# EAGLE design charger (EAGLE 9.6.2)
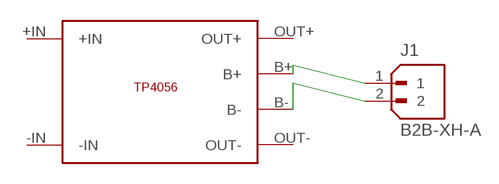
[diagram p0: schematic, sheet 1]

## Parts
J1  B2B-XH-A  [JST_B2B-XH-A]
U$1  TP4056  [TP4056]

## Nets
N$1: J1.1 U$1.B+
N$2: J1.2 U$1.B-
Unconnected: U$1.+IN U$1.-IN U$1.OUT+ U$1.OUT-

## Library data of the parts
J1 = B2B-XH-A:B2B-XH-A: Check availability <https://pricing.snapeda.com/parts/B2B-XH-A/JST%20Sales/view-part?ref=eda>; AVAILABILITY: In Stock; CHECK_PRICES: https://www.snapeda.com/parts/B2B-XH-A/JST+Sales+America+Inc./view-part/?ref=eda; DESCRIPTION: Connector Header Through Hole 2 position 0.098 (2.50mm); MF: JST Sales; MP: B2B-XH-A; PACKAGE: None; PRICE: None; PURCHASE-URL: https://www.snapeda.com/api/url_track_click_mouser/?unipart_id=552747&manufacturer=JST Sales&part_name=B2B-XH-A&search_term=b2bxh-a; SNAPEDA_LINK: https://www.snapeda.com/parts/B2B-XH-A/JST+Sales+America+Inc./view-part/?ref=snap
U$1 = TP4056:TP4056

## Board
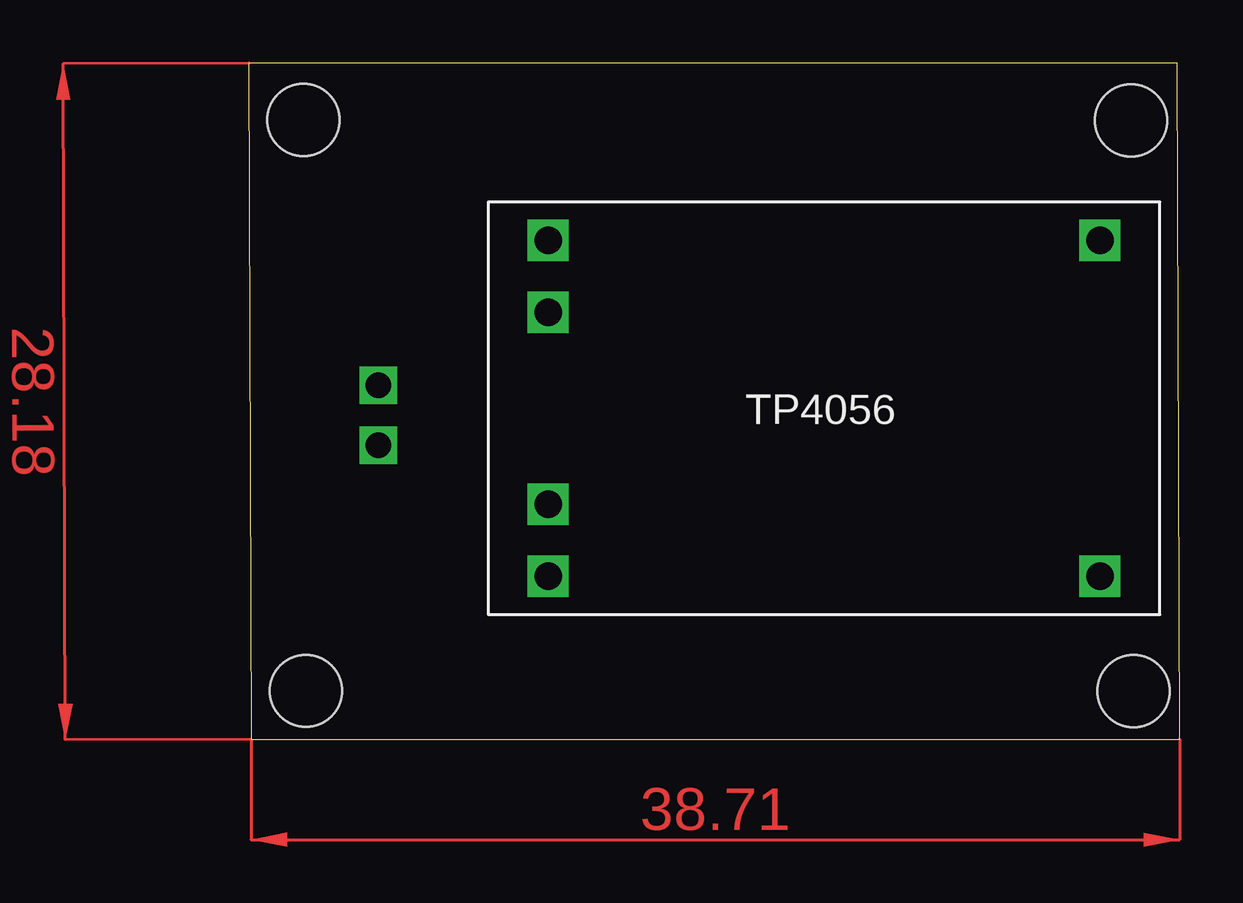
[diagram p1: board, top side]
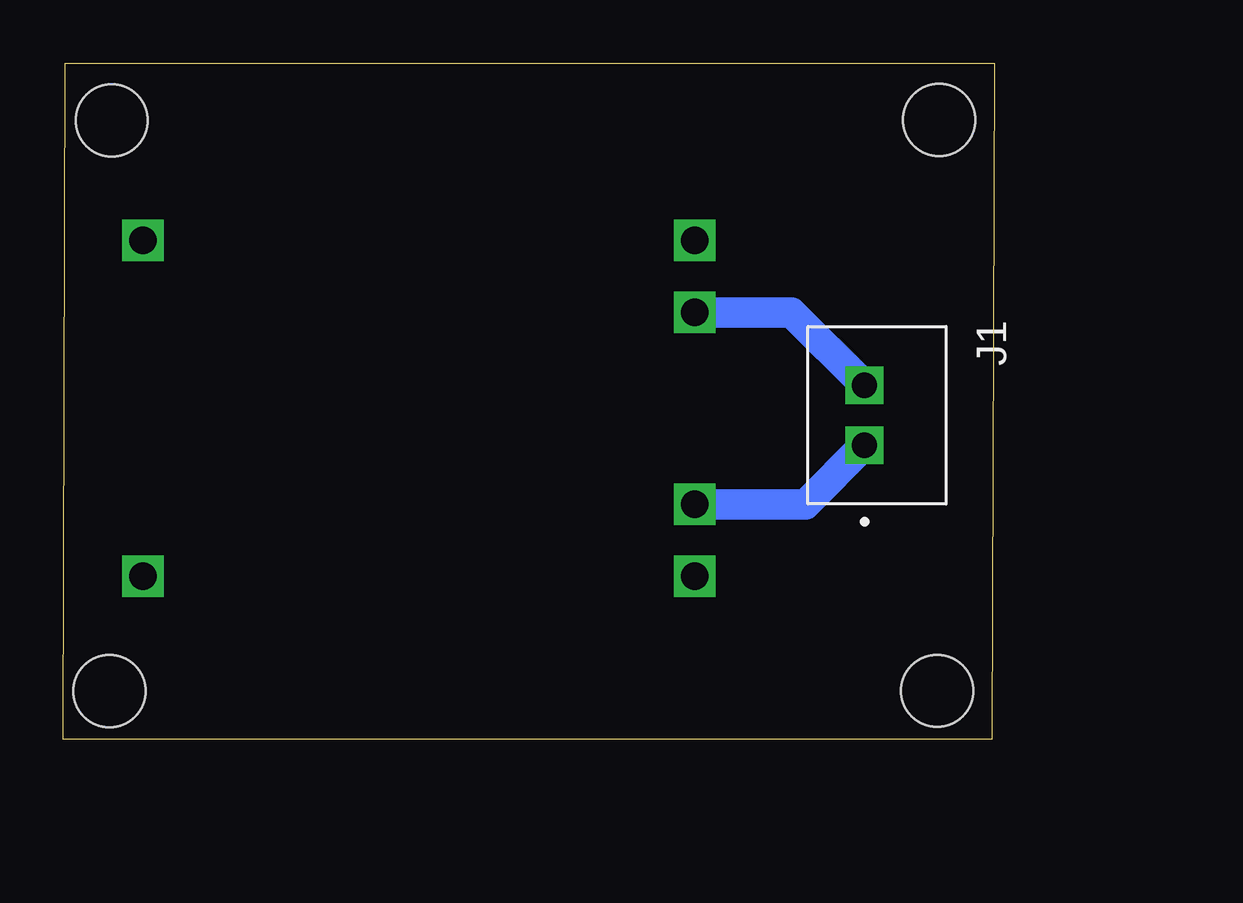
[diagram p2: board, bottom side, seen from below]

Size 38.81 x 28.19 mm. Coordinates in mm from the lower left corner, seen from the top.
Outline: 0.1,0 38.81,0 38.71,28.18 0,28.19 0.1,0
Copper layers (1*16): Top 0.035mm / dielectric 1.5mm / Bottom 0.035mm
Design rules "default *": minimum track width 16mil, minimum drill 0.35mm, track to track 16mil, track to pad 16mil, pad to pad 16mil, via to via 16mil, smd to smd 16mil, copper to edge 40mil, drill to drill 6mil, minimum pad ring 10mil, minimum via ring 8mil, stop-mask expansion 4mil, vias tented up to drill 0mil, thermal gap 10mil
Holes 3 mm at 2.38,2.02 36.88,2 36.78,25.79 2.29,25.81

### Footprints (pad centres in the part's own frame; a part is rotated, then mirrored left to right if it is on the bottom)
JST_B2B-XH-A = drill 1.05 square: 1 1.25,-0.525; 2 -1.25,-0.525
TP4056 = drill 1.143 square: +IN 2.5,15.6; -IN 2.5,1.6; B+ 25.5,12.6; B- 25.5,4.6; OUT+ 25.5,15.6; OUT- 25.5,1.6

### Placement (x,y rotation side)
J1  4.88,13.51 270 bottom
U$1  37.98,22.4 180 top

### Tracks (layer width: path | path; a pad name or v marks a point on that pad's centre or on a via)
N$1
  Bottom 1.27: J1.1 7.86,9.8 U$1.B+
N$2
  Bottom 1.27: J1.2 8.44,17.8 U$1.B-
(copper drawn outside any net)
  shapes: Top area x2